# Altium schematic sheet TestPoint.SchDoc
size A4; SheetNumber: 5; SheetTotal: 5
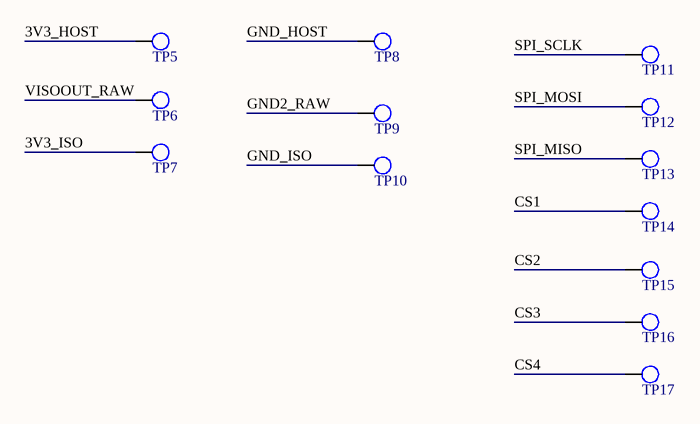
[diagram p0: TestPoint.SchDoc]

## Parts
TP5  TEST POINT  [TESTPOINT]  (value not drawn)
TP6  TEST POINT  [TESTPOINT]  (value not drawn)
TP7  TEST POINT  [TESTPOINT]  (value not drawn)
TP8  TEST POINT  [TESTPOINT]  (value not drawn)
TP9  TEST POINT  [TESTPOINT]  (value not drawn)
TP10  TEST POINT  [TESTPOINT]  (value not drawn)
TP11  TEST POINT  [TESTPOINT]  (value not drawn)
TP12  TEST POINT  [TESTPOINT]  (value not drawn)
TP13  TEST POINT  [TESTPOINT]  (value not drawn)
TP14  TEST POINT  [TESTPOINT]  (value not drawn)
TP15  TEST POINT  [TESTPOINT]  (value not drawn)
TP16  TEST POINT  [TESTPOINT]  (value not drawn)
TP17  TEST POINT  [TESTPOINT]  (value not drawn)

## Nets
3V3_HOST: TP5.1
3V3_ISO: TP7.1
CS1: TP14.1
CS2: TP15.1
CS3: TP16.1
CS4: TP17.1
GND2_RAW: TP9.1
GND_HOST: TP8.1
GND_ISO: TP10.1
SPI_MISO: TP13.1
SPI_MOSI: TP12.1
SPI_SCLK: TP11.1
VISOOUT_RAW: TP6.1